# EasyEDA Pro project FLASH.epro

# Schematic Schematic1
Board Name: Board1; Create Date: 2025-03-23; Page Name: P1; Project Name: spi flash; Schematic Name: Schematic1; Update Date: 2025-03-23; Company: 嘉立创EDA; Page Size: A4; Version: V1.0
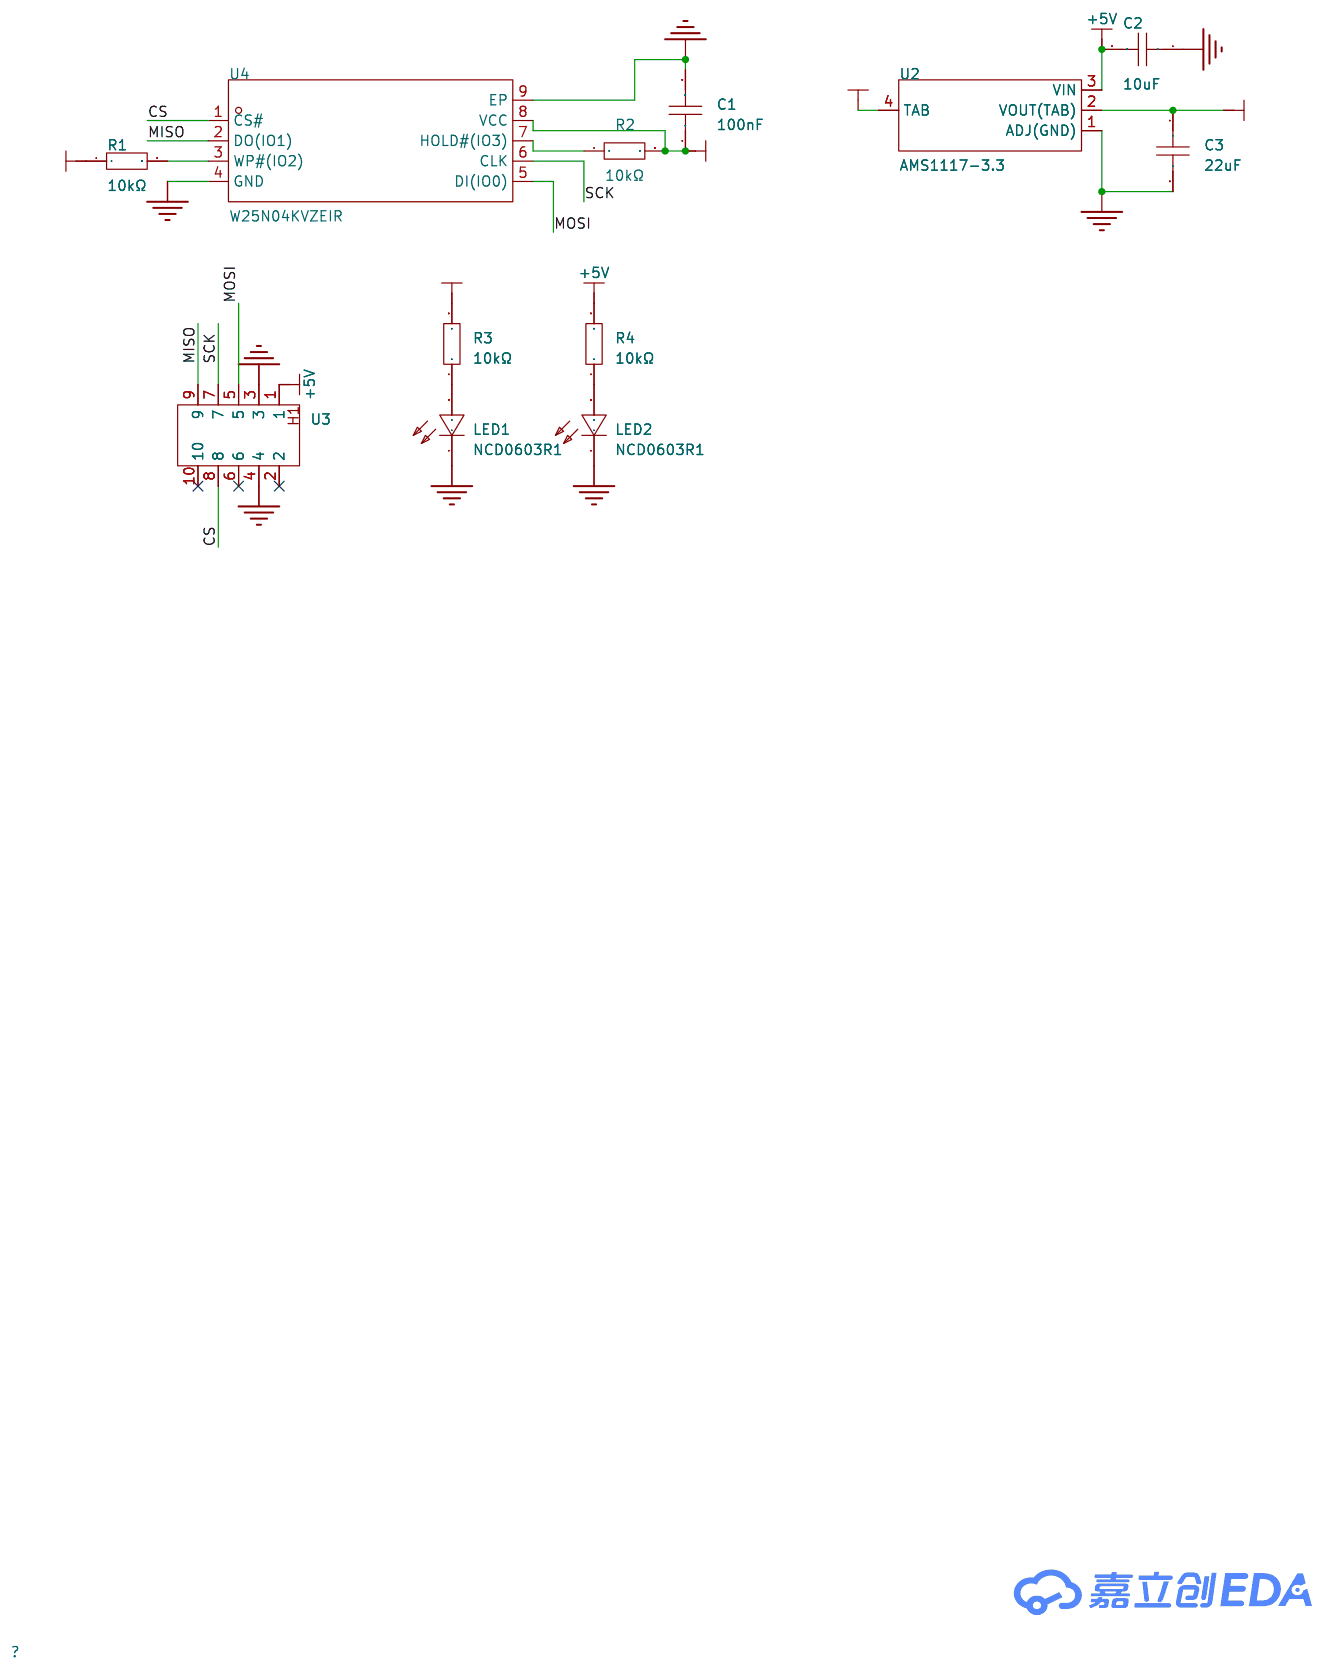
[diagram p0: schematic sheet]

## Parts
C1  100nF  [C0603]
C2  10uF  [C0603]
C3  22uF  [C0603]
LED1  NCD0603R1  [LED0603-RD_RED]
LED2  NCD0603R1  [LED0603-RD_RED]
R1  10kΩ  [R0603]
R2  10kΩ  [R0603]
R3  10kΩ  [R0603]
R4  10kΩ  [R0603]
U2  AMS1117-3.3  [SOT-223-4_L6.5-W3.5-P2.30-LS7.0-BR]
U3  -  [2_5 双面 排针]
U4  W25N04KVZEIR  [WSON-8_L8.0-W6.0-P1.27-TL-1]

## Library data of the parts
C1 = CGA0603X7R104K500JT: 容值:100nF;精度:±10%;额定电压:50V;温度系数:X7R;; LCSC Part Name: 100nF ±10% 50V; Supplier Part: C6119867; Manufacturer: HRE(芯声); Supplier Footprint: 0603; JLCPCB Part Class: Extended Part; Datasheet: https://atta.szlcsc.com/upload/public/pdf/source/20250103/C44077DA9E7B3EFAE02F22B6D3D1CBC9.pdf; Supplier: LCSC; Tolerance: ±10%; Voltage Rating: 50V; Temperature Coefficient: X7R
C2 = CGA0603X5R106K100JT: 容值:10uF;精度:±10%;额定电压:10V;温度系数:X5R;; LCSC Part Name: 10uF ±10% 10V; Supplier Part: C6119842; Manufacturer: HRE(芯声); Supplier Footprint: 0603; JLCPCB Part Class: Extended Part; Supplier: LCSC; Tolerance: ±10%; Voltage Rating: 10V; Temperature Coefficient: X5R
C3 = CGA0603X5R226M160JT: 容值:22uF;精度:±20%;额定电压:16V;温度系数:X5R;; LCSC Part Name: 22uF ±20% 16V; Supplier Part: C6119868; Manufacturer: HRE(芯声); Supplier Footprint: 0603; JLCPCB Part Class: Extended Part; Datasheet: https://atta.szlcsc.com/upload/public/pdf/source/20250121/36E435B8815E1026A710792D223DB526.pdf; Supplier: LCSC; Tolerance: ±20%; Voltage Rating: 16V; Temperature Coefficient: X5R
LED1 LED2 = NCD0603R1_C84263: 灯头类型:-;发光颜色:红色;正向压降(Vf):1.6V~2.6V;功率:65mW;正向电流:25mA;波长:615nm~630nm;二极管配置:独立二极管;透镜颜色:-;色温:-;发光强度:80mcd~220mcd;发光角度:130°;载带方式:-;工作温度:-30℃~+85℃;; Supplier Part: C84263; Manufacturer: 国星光电; Supplier Footprint: 0603; JLCPCB Part Class: Extended Part; Datasheet: https://atta.szlcsc.com/upload/public/pdf/source/20200820/C84263_DABC6A75E58F576973B407FDBA283D60.pdf; Supplier: LCSC; Illumination Color: 红色; Voltage - Forward(Vf): 1.6V~2.6V; Power(Watts): 65mW; Forward Current: 25mA; Wavelength - Dominant: 615nm~630nm; Diode Configuration: 独立二极管; Luminous Intensity: 80mcd~220mcd; Viewing Angle: 130°; Operating Temperature: -30℃~+85℃
R1-R4 = 0603WAF1002T5E: 电阻类型:厚膜电阻;阻值:10kΩ;精度:±1%;功率:100mW;最大工作电压:75V;温度系数:±100ppm/℃;; LCSC Part Name: 厚膜电阻 10kΩ ±1% 100mW; Supplier Part: C25804; Manufacturer: UNI-ROYAL(厚声); Supplier Footprint: 0603; JLCPCB Part Class: Basic Part; Datasheet: https://atta.szlcsc.com/upload/public/pdf/source/20200306/C422600_1E6D84923E4A46A82E41ADD87F860B5C.pdf; Supplier: LCSC; Type: 厚膜电阻; Tolerance: ±1%; Power(Watts): 100mW; Overload Voltage (Max): 75V; Temperature Coefficient: ±100ppm/℃; Operating Temperature Range: -55℃~+155℃
U2 = AMS1117-3.3_C347222: 输出类型:固定;工作电压:12V;输出电压:3.3V;输出电流:1A;电源纹波抑制比(PSRR):60dB@(120Hz);输出极性:正极;; LCSC Part Name: 输出:3.3V 电流:1A 耐压:12V; Supplier Part: C347222; Manufacturer: UMW(友台半导体); Supplier Footprint: SOT-223; JLCPCB Part Class: Extended Part; Datasheet: https://atta.szlcsc.com/upload/public/pdf/source/20241218/BAF0263FA2E44BCD8AF41AA4FA04EFAA.pdf; Supplier: LCSC; Output Type: 固定; Voltage - Supply: 12V; Output Voltage: 3.3V; Output Current: 1A; Power Supply Rejection Ratio (PSRR): 60dB@(120Hz); Voltage Dropout: 1.3V@(1A); Features: 过流保护; Output Configuration: 正极; Number of Outputs: 1
U3 = 2*5 双面
U4 = W25N04KVZEIR: 存储容量:4Gbit;时钟频率(fc):104MHz;工作电压:2.7V~3.6V;; Supplier Part: C5342170; Manufacturer: WINBOND(华邦); Supplier Footprint: WSON-8(6x8); JLCPCB Part Class: Extended Part; Datasheet: https://atta.szlcsc.com/upload/public/pdf/source/20230606/17A9C717CFB377A9AF5DDAA04947A228.pdf; Supplier: LCSC; Memory Size: 4Gbit; Clock Frequency (fc): 104MHz; Supply Voltage: 2.7V~3.6V; Page Program time (TPP): 250us; Block Erase Time (tBE): 2ms; Data Retention - TDR (Year): 10年; Operating Temperature: -40℃~+85℃; Interface Type: SPI

## Nets
+5V: C2.2 R4.2 U2.3(VIN) U3.1
GND: C1.2 C2.1 C3.2 LED1.1(K) LED2.1(K) U2.1(ADJ(GND)) U3.3 U3.4 U4.4(GND) U4.9(EP)
VCC-3.3: C1.1 C3.1 R1.1 R2.2 R3.2 U2.2(VOUT(TAB)) U2.4(TAB) U4.8(VCC)
CS: U3.8 U4.1(CS#)
MISO: U3.9 U4.2(DO(IO1))
MOSI: U3.5 U4.5(DI(IO0))
SCK: U3.7 U4.6(CLK)
$1N301: R1.2 U4.3(WP#(IO2))
$1N371: R2.1 U4.7(HOLD#(IO3))
$1N2543: LED1.2(A) R3.1
$1N2627: LED2.2(A) R4.1

Not connected (* = marked no-connect by the designer): U3 2* 6* 10*

# Board PCB1
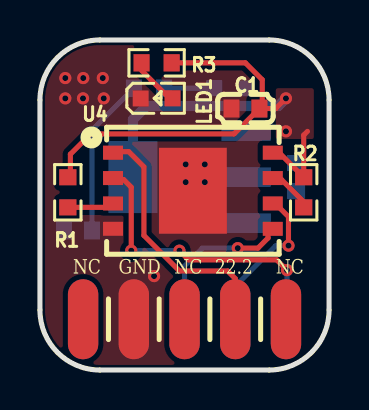
[diagram p1: board, top side]
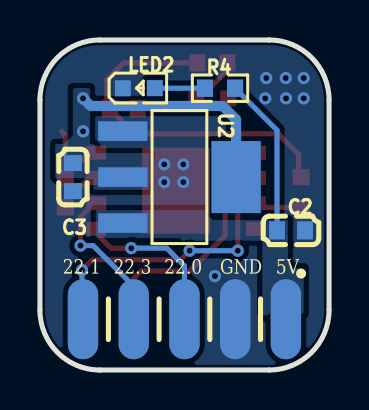
[diagram p2: board, bottom side, seen from below]

Outline 14.48 x 16.51 mm; copper layers: Top Layer, Bottom Layer. Coordinates in mm from the lower left corner of the outline.
Outline path: 0,13.51 0,3 arc(0.88,0.88) 3,0 11.48,0 arc(13.6,0.88) 14.48,3 14.48,13.51 arc(13.6,15.63) 11.48,16.51 3,16.51 arc(0.88,15.63) 0,13.51
Stack: Top Layer 0.035mm / Dielectric1 1.51mm FR4 er 4.5 / Bottom Layer 0.035mm

## Design rules (mm)
template: 自定义配置
spacing copperThickness1oz (default): track to track 0.102, other pairs 0.152 to 0.3
spacing copperThickness2oz: track to track 0.203, other pairs 0.152 to 0.3
track width copperThickness1oz (default): min 0.127, default 0.254, max 2.54
track width copperThickness2oz: min 0.203, default 0.254, max 2.54
differential pair differentialPair (default): width min 0.127, default 0.254, max 2.54; gap min 0.152, default 0.152
via viaSize (default): diameter min 0.5, default 0.61, max 10; hole min 0.3, default 0.305, max 6.3

## Placement (name value [footprint] x y rotation side)
C1  100nF  [C0603]  10.29 13.08 180 top
C2  10uF  [C0603]  1.91 6.98 0 bottom
C3  22uF  [C0603]  12.83 9.65 270 bottom
LED1  NCD0603R1  [LED0603-RD_RED]  5.84 13.59 0 top
LED2  NCD0603R1  [LED0603-RD_RED]  9.53 14.1 180 bottom
R1  10kΩ  [R0603]  1.4 8.89 270 top
R2  10kΩ  [R0603]  13.21 8.89 90 top
R3  10kΩ  [R0603]  5.84 15.37 0 top
R4  10kΩ  [R0603]  5.46 14.1 180 bottom
U2  AMS1117-3.3  [SOT-223-4_L6.5-W3.5-P2.30-LS7.0-BR]  7.49 9.65 0 bottom
U3  -  [2_5 双面 排针]  7.24 2.54 270 bottom
U4  W25N04KVZEIR  [WSON-8_L8.0-W6.0-P1.27-TL-1]  7.66 8.97 0 top

## Footprints (pads in the part's own frame, mm; a bottom-side part is the same pattern mirrored in y, then rotated)
2_5 双面 排针
  oval 4x1.52 smd: 1(0,5.08) 3(0,2.54) 5(0,0) 7(0,-2.54) 9(0,-5.08)
  oval 4x1.52 smd far side: 2(0,5.08) 4(0,2.54) 6(0,0) 8(0,-2.54) 10(0,-5.08)
C0603
  rect 0.8x0.9 smd: 1(-0.7,0) 2(0.7,0)
LED0603-RD_RED
  rect 0.8x0.8 smd: 1(-0.799,-0.004) 2(0.799,0.004)
R0603
  rect 0.806x0.864 smd: 1(-0.753,0) 2(0.753,0)
SOT-223-4_L6.5-W3.5-P2.30-LS7.0-BR
  rect 2.47x0.98 smd: 1(2.835,-2.3) 2(2.835,0) 3(2.835,2.3)
  rect 2.47x3.6 smd: 4(-2.835,0)
WSON-8_L8.0-W6.0-P1.27-TL-1
  rect 1x0.7 smd: 1(-4,1.905) 2(-4,0.635) 3(-4,-0.635) 4(-4,-1.905) 5(4,-1.905) 6(4,-0.635) 7(4,0.635) 8(4,1.905)
  rect 3.4x4.3 smd: 9(0,0)

## Nets
As in the schematic.

Pads without a net: U3 2 6 10

## Via types
v1: diameter 0.61, hole 0.305, Top Layer to Bottom Layer, 18 vias

## Routing (per net, layer and track width the routed paths; a pad name or vN(x,y) marks a point on that pad's centre or on a via; arc(x,y) is an arc through that point)
+5V: length 8
  Bottom Layer w0.254: R4.2 2.61,11.99 C2.2
GND:
  vias: v1(1.27,14.6) v1(1.27,13.59) v1(2.17,14.6) v1(2.16,13.59) v1(3.15,14.6) v1(3.2,13.59) v1(5.72,4.7) v1(7.3,10.29) v1(7.3,9.4) v1(8.25,10.29) v1(8.25,9.4)
VCC-3.3: length 35.2
  Top Layer w0.254: R3.2 10.29,15.37 11.13,14.52 11.13,13.22 C1.1 ; v1(12.32,13.59) 11.81,13.08 C1.1 ; 11.42,10.79 12.06,10.79 R2.2 13.21,11.75 13.4,11.94 ; C1.1 9.72,11.81 2.54,11.81 1.52,10.79 1.52,9.77 R1.1
  Bottom Layer w0.508: v1(12.32,13.59) 11.94,13.21 5.33,13.21 4.66,12.53 U2.4
  vias: v1(12.32,11.94)
CS: length 12.9
  Top Layer w0.254: 3.62,10.79 3.75,10.92 4.44,10.92 5.21,10.16 5.21,6.73 6.99,4.95 9.4,4.95 9.78,4.57 U3.8
MISO: length 15
  Top Layer w0.254: 3.62,9.52 4.19,9.52 4.57,9.14 v1(4.57,5.97) ; v1(12.37,5) 11.86,5.51 7.44,5.51 v1(6.99,5.97)
  Bottom Layer w0.254: 12.32,2.54 12.37,2.59 v1(12.37,5) ; v1(6.99,5.97) v1(4.57,5.97)
MOSI: length 7.8
  Top Layer w0.254: v1(9.91,6.1) 10.91,6.1 11.42,6.6 11.42,6.98
  Bottom Layer w0.254: U3.5 7.24,5.21 8.13,6.1 v1(9.91,6.1)
SCK: length 7.9
  Top Layer w0.254: 11.42,8.25 11.86,8.25 12.45,7.67 v1(12.45,6.22)
  Bottom Layer w0.254: v1(12.45,6.22) 11.81,6.22 9.75,4.16 9.75,2.57 U3.7
$1N301: length 2.3
  Top Layer w0.254: 3.62,8.25 3.5,8.14 R1.2
$1N371: length 2.5
  Top Layer w0.254: R2.1 13.21,8.41 12.1,9.52 11.42,9.52
$1N2543: length 2.4
  Top Layer w0.254: 5.09,14.99 6.64,13.43 LED1.2
$1N2627: length 2.5
  Bottom Layer w0.254: R4.1 8.72,14.1 LED2.2

## Copper pours and planes (outline as drawn; the poured copper is in the pictures)
+5V on Bottom Layer: 5.84,8 11.68,8 11.68,6.6 5.84,6.6
+5V on Bottom Layer: 2.06,7.5 7.24,7.5 7.49,7.76 7.49,6.6 7.37,6.48 2.37,6.48 2.06,6.79
+5V on Bottom Layer: 2.06,7.5 2.06,5.37 1.78,5.09 1.27,5.09 1.27,2.81 3.03,2.81 3.18,2.67 3.34,2.83 3.34,7.33 3.16,7.5
GND on Top Layer: -0.51,17.65 15.24,17.65 15.24,-1.4 -0.51,-1.4
GND on Bottom Layer: -2.92,18.8 15.37,18.8 15.37,-1.78 -2.92,-1.78
VCC-3.3 on Top Layer: 11.81,14.1 13.72,14.1 13.72,11.56 11.81,11.56
VCC-3.3 on Bottom Layer: 9.02,10.67 9.02,9.02 11.8,9.02 11.8,9.54 13.61,9.54 13.72,9.65 13.72,11.31 11.81,11.31 11.68,11.18 11.68,10.85 8.98,10.85 8.98,10.71
VCC-3.3 on Bottom Layer: 11.97,14.1 11.97,9.99 12.31,9.65 13.34,9.65 13.54,9.85 13.54,11.04 12.83,11.74 12.83,14.1 12.82,14.1

## Text on the board
Bottom Silkscreen Layer: 5V | GND | 22.0 | 22.3 | 22.1
Top Silkscreen Layer: NC | GND | 22.2
